# EAGLE design untitled (EAGLE 9.5.1)
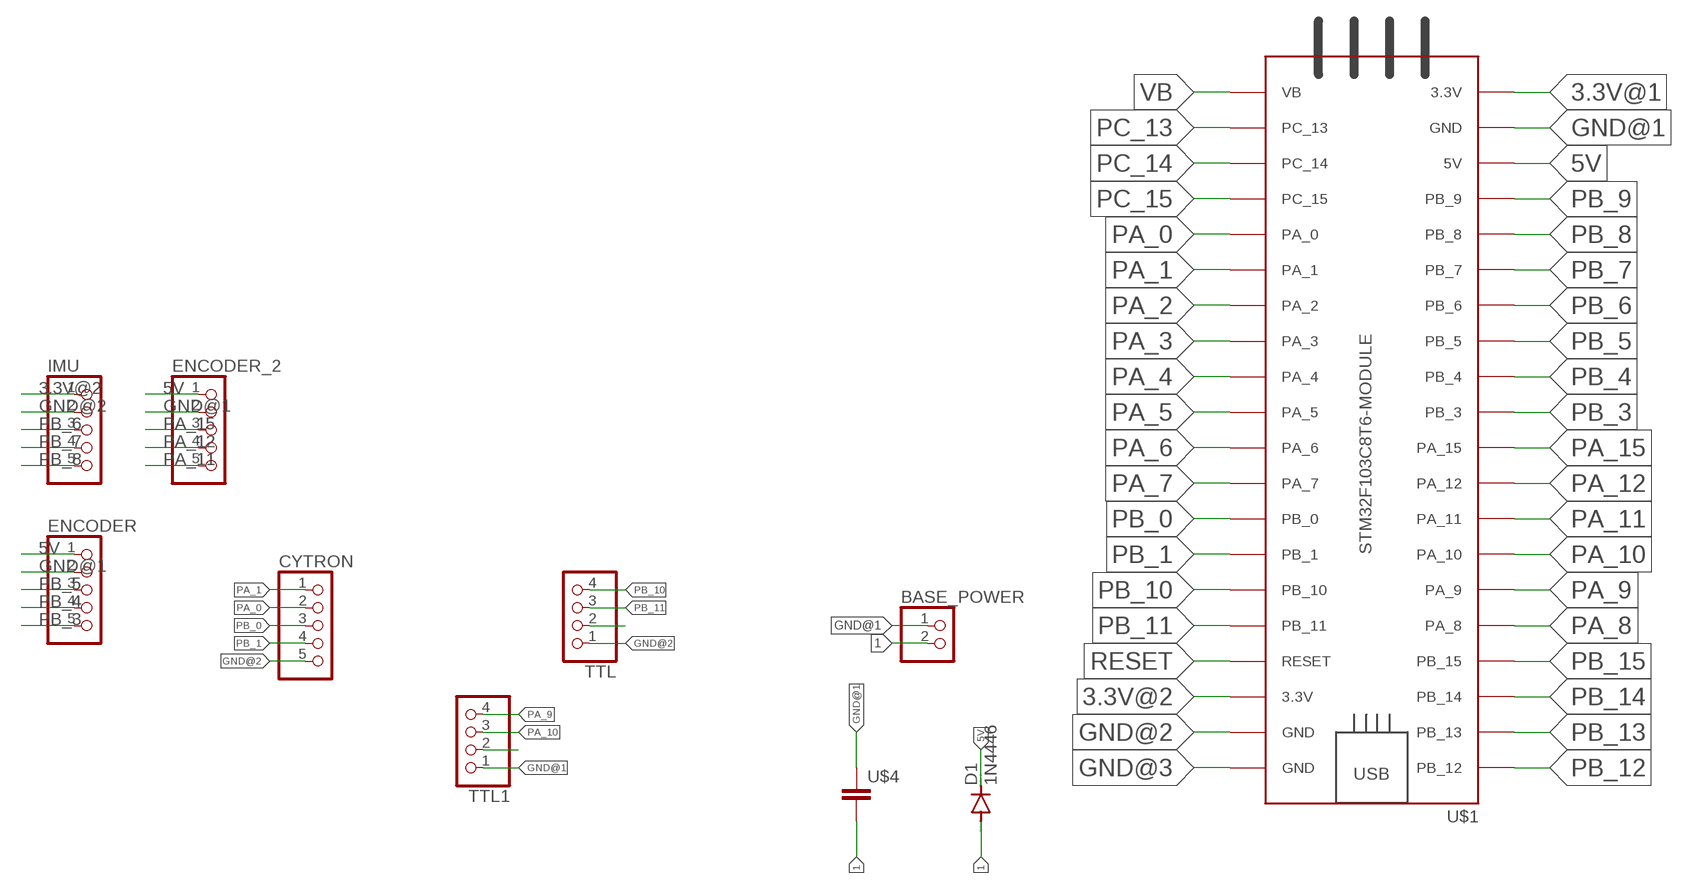
[diagram p0: schematic, sheet 1]

## Parts
BASE_POWER  PINHD-2_DATA  [1X02_DATA]
CYTRON  PINHD-5_DATA  [1X05_DATA]
D1  1N4446  [DO35-10]
ENCODER  PINHD-5_DATA  [1X05_DATA]
ENCODER_2  PINHD-5_DATA  [1X05_DATA]
IMU  PINHD-5_DATA  [1X05_DATA]
TTL  PINHD-4_DATA  [1X04_DATA]
TTL1  PINHD-4_DATA  [1X04_DATA]
U$1  STM32F103C8T6-MODULE  [STM32F103C8T6-MODULE]
U$4  CAPACITOR  [C025-025X050]

## Nets
1: BASE_POWER.2 D1.A U$4.2
3.3V@1: U$1.3.3V_1(3.3V)
3.3V@2: IMU.1 U$1.3.3V_2(3.3V)
5V: D1.C ENCODER.1 ENCODER_2.1 TTL1.2 TTL.2 U$1.5V
GND@1: BASE_POWER.1 ENCODER.2 ENCODER_2.2 TTL1.1 U$1.GND_1(GND) U$4.1
GND@2: CYTRON.5 IMU.2 TTL.1 U$1.GND_2(GND)
GND@3: U$1.GND_3(GND)
PA_0: CYTRON.2 U$1.PA_0
PA_1: CYTRON.1 U$1.PA_1
PA_2: U$1.PA_2
PA_3: U$1.PA_3
PA_4: U$1.PA_4
PA_5: U$1.PA_5
PA_6: U$1.PA_6
PA_7: U$1.PA_7
PA_8: U$1.PA_8
PA_9: TTL1.4 U$1.PA_9
PA_10: TTL1.3 U$1.PA_10
PA_11: ENCODER_2.5 U$1.PA_11
PA_12: ENCODER_2.4 U$1.PA_12
PA_15: ENCODER_2.3 U$1.PA_15
PB_0: CYTRON.3 U$1.PB_0
PB_1: CYTRON.4 U$1.PB_1
PB_3: ENCODER.5 U$1.PB_3
PB_4: ENCODER.4 U$1.PB_4
PB_5: ENCODER.3 U$1.PB_5
PB_6: IMU.3 U$1.PB_6
PB_7: IMU.4 U$1.PB_7
PB_8: IMU.5 U$1.PB_8
PB_9: U$1.PB_9
PB_10: TTL.4 U$1.PB_10
PB_11: TTL.3 U$1.PB_11
PB_12: U$1.PB_12
PB_13: U$1.PB_13
PB_14: U$1.PB_14
PB_15: U$1.PB_15
PC_13: U$1.PC_13
PC_14: U$1.PC_14
PC_15: U$1.PC_15
RESET: U$1.RESET
VB: U$1.VB

## Library data of the parts
BASE_POWER = MIA_LIBRARY-2-2-2:PINHD-2_DATA: PIN HEADER
CYTRON ENCODER ENCODER_2 IMU = MIA_LIBRARY-2-2-2:PINHD-5_DATA: PIN HEADER
D1 = diode:1N4446: DIODE high speed (Philips)
TTL TTL1 = MIA_LIBRARY-2-2-2:PINHD-4_DATA: PIN HEADER
U$1 = MIA_LIBRARY-2-2-2:STM32F103C8T6-MODULE: STM32F103C8T6 module with ARM Cortex-3, 20kB SRAM, 64kB Flash, 72MHz
U$4 = MIA_LIBRARY-2-2-2:CAPACITOR

## Board
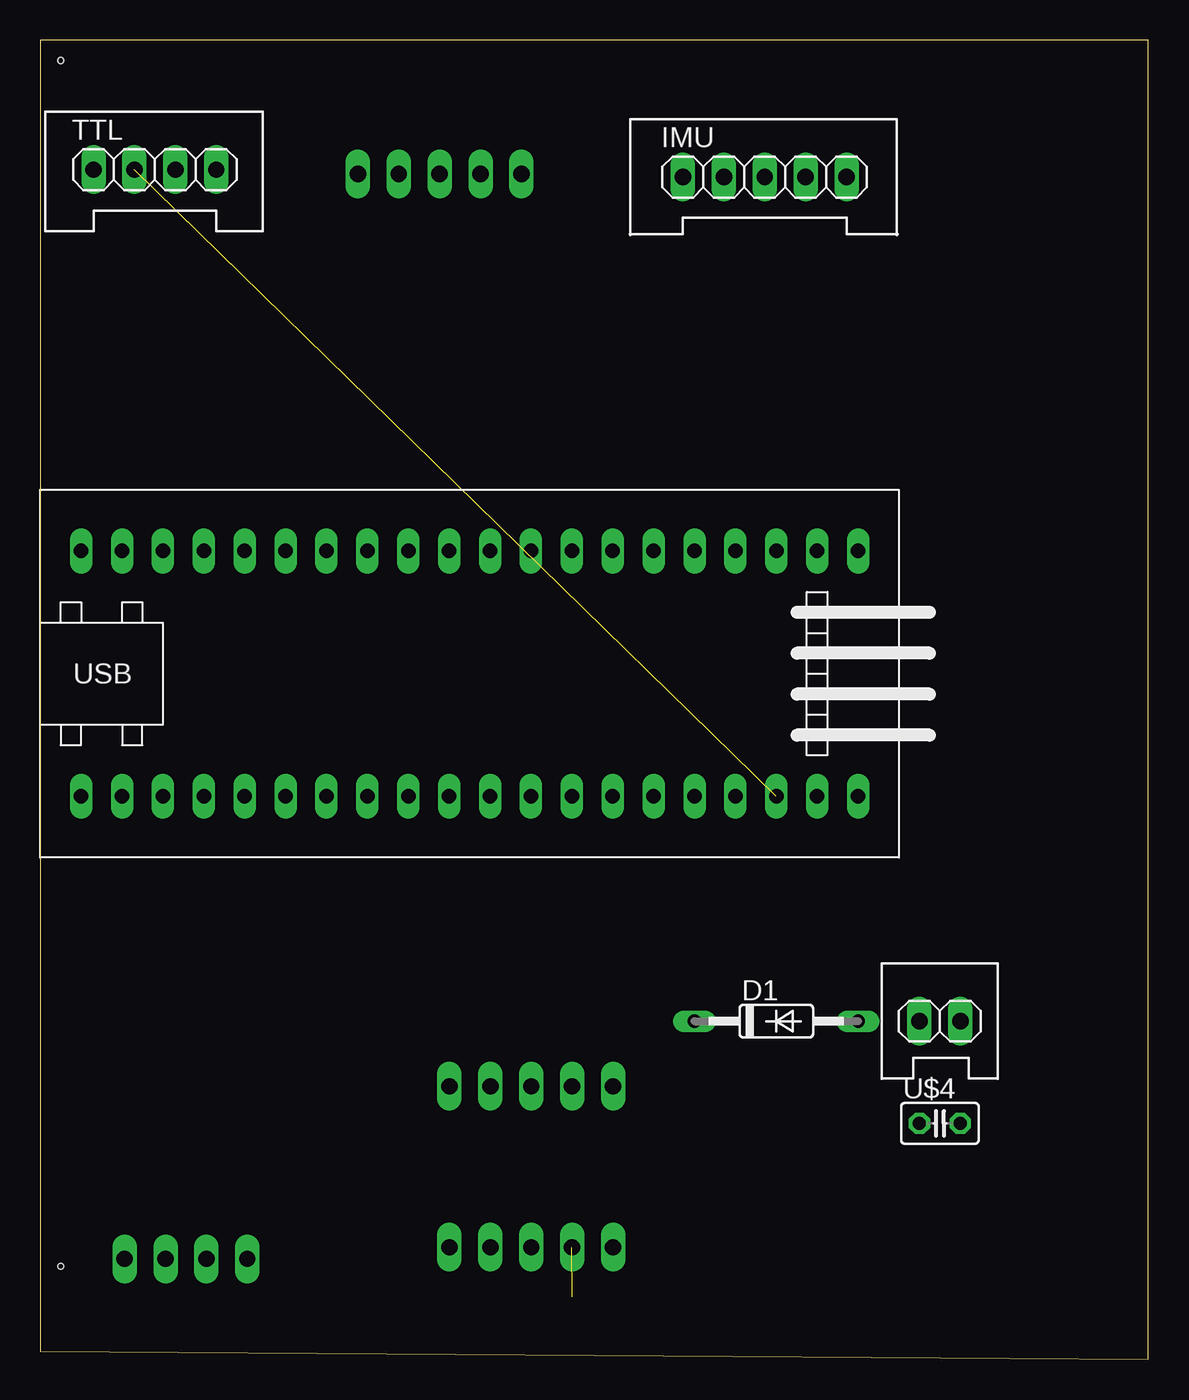
[diagram p1: board, top side]
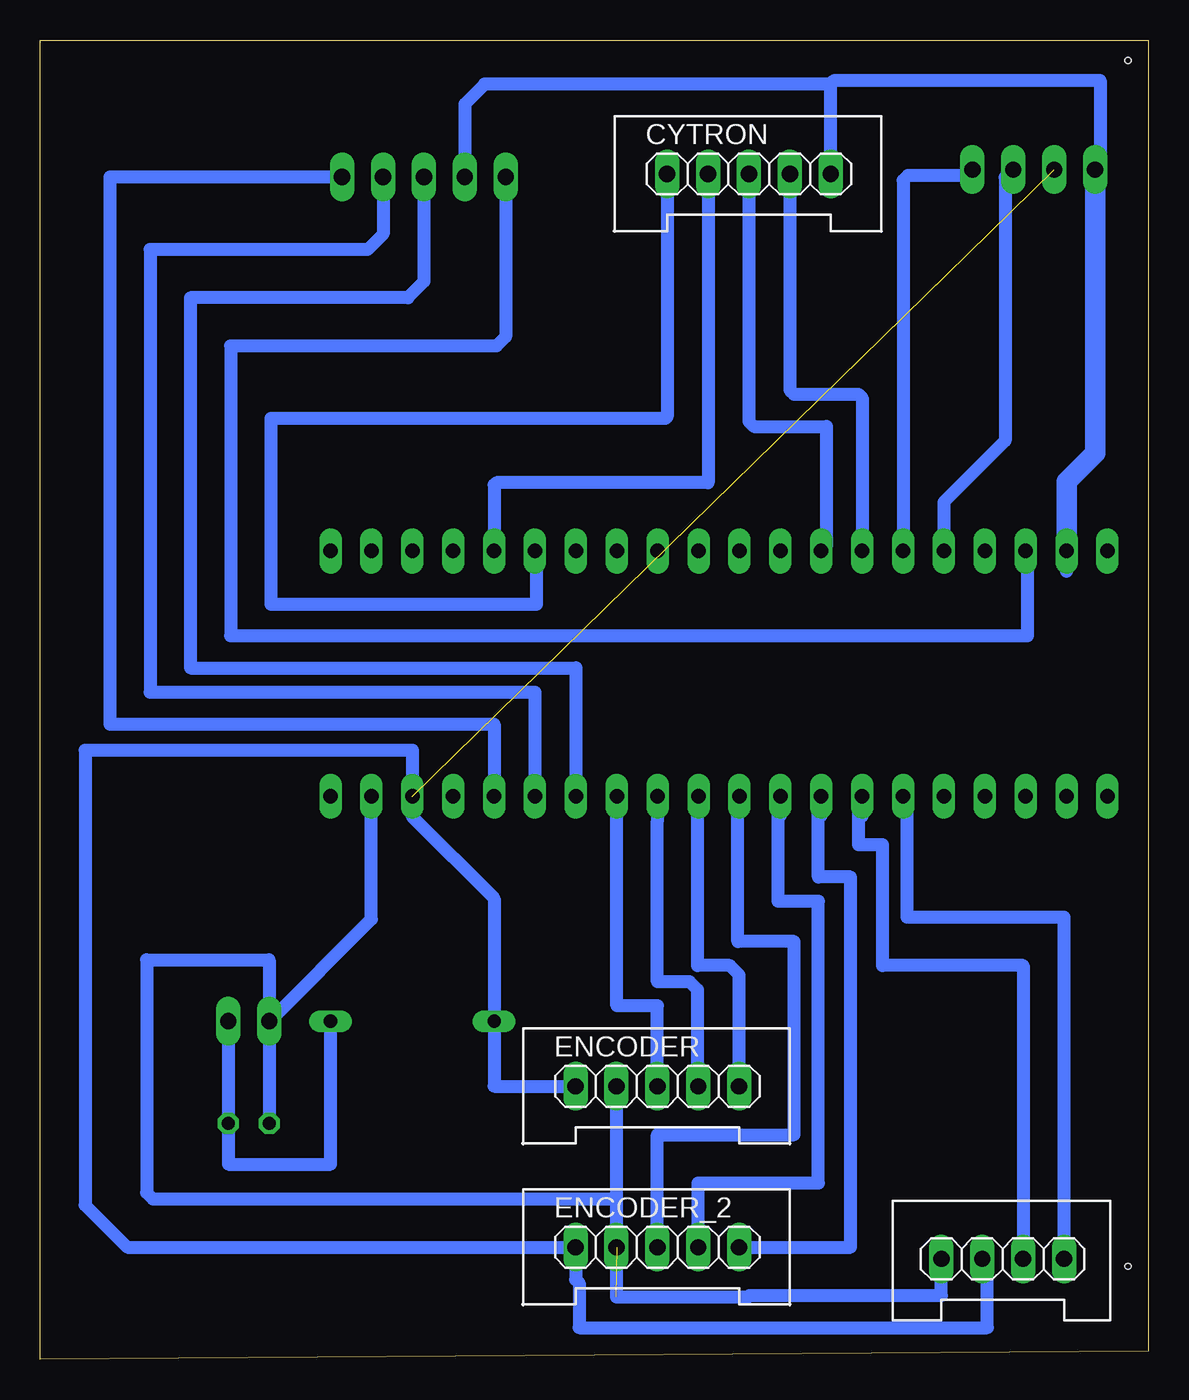
[diagram p2: board, bottom side, seen from below]

Size 68.83 x 81.96 mm. Coordinates in mm from the lower left corner, seen from the top.
Outline: 0,0.5 68.83,0 68.83,81.96 0,81.96 0,0.5
Copper layers (1*16): Top 0.035mm / dielectric 1.5mm / Bottom 0.035mm
Design rules "default": minimum track width 6mil, minimum drill 0.35mm, track to track 6mil, track to pad 6mil, pad to pad 6mil, via to via 6mil, smd to smd 6mil, copper to edge 40mil, drill to drill 6mil, minimum pad ring 10mil, minimum via ring 8mil, stop-mask expansion 4mil, vias tented up to drill 0mil, thermal gap 10mil
Holes 0.35 mm at 1.27,80.7 72.39,80.7 72.39,5.77 1.27,5.77

### Footprints (pad centres in the part's own frame; a part is rotated, then mirrored left to right if it is on the bottom)
1X02_DATA = drill 1.016 long: 1 -1.27,0; 2 1.27,0
1X05_DATA = drill 1.016 long: 1 -5.08,0; 2 -2.54,0; 3 0,0; 4 2.54,0; 5 5.08,0
DO35-10 = drill 0.813 long: A 5.08,0; C -5.08,0
1X04_DATA = drill 1.016 long: 1 -3.81,0; 2 -1.27,0; 3 1.27,0; 4 3.81,0
STM32F103C8T6-MODULE = drill 0.9 long: 3.3V_1 25.4,-7.62; 3.3V_2 -17.78,7.62; 5V 20.32,-7.62; GND_1 22.86,-7.62; GND_2 -20.32,7.62; GND_3 -22.86,7.62; PA_0 15.24,7.62; PA_1 12.7,7.62; PA_2 10.16,7.62; PA_3 7.62,7.62; PA_4 5.08,7.62; PA_5 2.54,7.62; PA_6 0,7.62; PA_7 -2.54,7.62; PA_8 -12.7,-7.62; PA_9 -10.16,-7.62; PA_10 -7.62,-7.62; PA_11 -5.08,-7.62; PA_12 -2.54,-7.62; PA_15 0,-7.62; PB_0 -5.08,7.62; PB_1 -7.62,7.62; PB_3 2.54,-7.62; PB_4 5.08,-7.62; PB_5 7.62,-7.62; PB_6 10.16,-7.62; PB_7 12.7,-7.62; PB_8 15.24,-7.62; PB_9 17.78,-7.62; PB_10 -10.16,7.62; PB_11 -12.7,7.62; PB_12 -22.86,-7.62; PB_13 -20.32,-7.62; PB_14 -17.78,-7.62; PB_15 -15.24,-7.62; PC_13 22.86,7.62; PC_14 20.32,7.62; PC_15 17.78,7.62; RESET -15.24,7.62; VB 25.4,7.62
C025-025X050 = drill 0.813 octagon: 1 -1.27,0; 2 1.27,0

### Placement (x,y rotation side)
BASE_POWER  55.88,21.01 0 top
CYTRON  24.81,73.65 0 bottom
D1  45.72,21.01 0 top
ENCODER  30.5,16.96 0 bottom
ENCODER_2  30.5,6.96 0 bottom
IMU  45,73.46 0 top
TTL  7.12,73.92 0 top
TTL1  9.05,6.24 0 bottom
U$1  25.4,42.6 0 top
U$4  55.88,14.66 0 top

### Tracks (layer width: path | path; a pad name or v marks a point on that pad's centre or on a via)
1
  Bottom 0.813: BASE_POWER.2 U$4.2 57.15,12.12 50.8,12.12 D1.A
3.3V@2
  Bottom 0.813: IMU.1 39.92,63.54 40.5,62.96 57,62.96 57,44.96 7.5,44.96 7.5,50.1 U$1.3.3V_2
5V  (1 unrouted)
  Bottom 0.813: D1.C 40.64,28.63 45.72,33.71 U$1.5V 45.72,37.85 66.04,37.85 66.04,9.58 63.42,6.96 ENCODER_2.1 35.58,4.96 35.36,4.74 35.36,1.96 10,1.96 10,5.92 TTL1.2 | D1.C 40.59,20.96 | D1.C 40.64,16.96 ENCODER.1
GND@1  (1 unrouted)
  Bottom 0.813: BASE_POWER.1 U$4.1 | BASE_POWER.1 48.26,27.36 U$1.GND_1 | BASE_POWER.1 54.61,24.82 62.23,24.82 62.23,10.35 61.84,9.96 33.04,9.96 | ENCODER.2 33.04,9.96 | 33.04,9.96 33.04,7 33,6.96 | ENCODER_2.2 33.04,3.88 24.87,3.88 24.79,3.96 12.86,3.96 TTL1.1
GND@2
  Bottom 0.813: 5.08,48.95 U$1.GND_2 | CYTRON.5 19.73,79.23 | 19.73,79.23 19.5,79.46 3,79.46 3,74.23 TTL.1 | 19.73,79.23 41.23,79.23 42.46,78 IMU.2
  Bottom 1.27: TTL.1 3.31,56.3 5.08,54.53 U$1.GND_2
PA_0
  Bottom 0.813: CYTRON.2 27.35,54.46 40.5,54.46 40.64,54.32 U$1.PA_0
PA_1
  Bottom 0.813: CYTRON.1 29.89,58.57 30,58.46 54.5,58.46 54.5,46.93 38,46.93 38,50.12 U$1.PA_1
PA_9
  Bottom 0.813: TTL1.4 5.24,27.46 15,27.46 15,34.74 U$1.PA_9
PA_10
  Bottom 0.813: 17.78,33.74 17.78,34.46 | 17.78,34.46 U$1.PA_10 | TTL1.3 7.78,24.46 16.5,24.46 16.5,31.96 18,31.96 18,34.24 17.78,34.46
PA_11
  Bottom 0.813: 20.32,33.78 U$1.PA_11 20.5,34.8 20.5,29.96 18.5,29.96 18.5,6.96 ENCODER_2.5
PA_12
  Bottom 0.813: 22.86,33.82 U$1.PA_12 23,34.84 23,28.46 20.5,28.46 20.5,10.96 27.96,10.96 ENCODER_2.4
PA_15
  Bottom 0.813: U$1.PA_15 25.5,34.88 25.5,25.96 22,25.96 22,13.96 30.5,13.96 ENCODER_2.3
PB_0
  Bottom 0.813: CYTRON.3 24.81,58.27 24.5,57.96 20,57.96 20,50.54 U$1.PB_0
PB_1
  Bottom 0.813: CYTRON.4 22.27,60.23 22,59.96 18,59.96 17.78,59.74 U$1.PB_1
PB_3
  Bottom 0.813: U$1.PB_3 28,34.92 28,24.46 26,24.46 25.42,23.88 ENCODER.5
PB_4
  Bottom 0.813: 30.5,34.96 U$1.PB_4 30.48,33.48 30.5,33.46 30.5,23.46 28.5,23.46 28,22.96 28,17 ENCODER.4
PB_5
  Bottom 0.813: ENCODER.3 30.5,21.96 33.02,21.96 U$1.PB_5
PB_6
  Bottom 0.813: IMU.3 45,66.96 46,65.96 59.5,65.96 59.5,42.96 35.56,42.96 U$1.PB_6
PB_7
  Bottom 0.813: IMU.4 47.54,69.92 48.5,68.96 62,68.96 62,41.46 38.1,41.46 U$1.PB_7
PB_8
  Bottom 0.813: U$1.PB_8 40.64,39.46 64.5,39.46 64.5,73.46 IMU.5
PB_10
  Bottom 0.813: TTL.4 11.28,73.57 14.93,73.57 15.24,73.26 U$1.PB_10
PB_11
  Bottom 0.813: TTL.3 8.89,73.42 8.89,57.07 12.7,53.26 U$1.PB_11